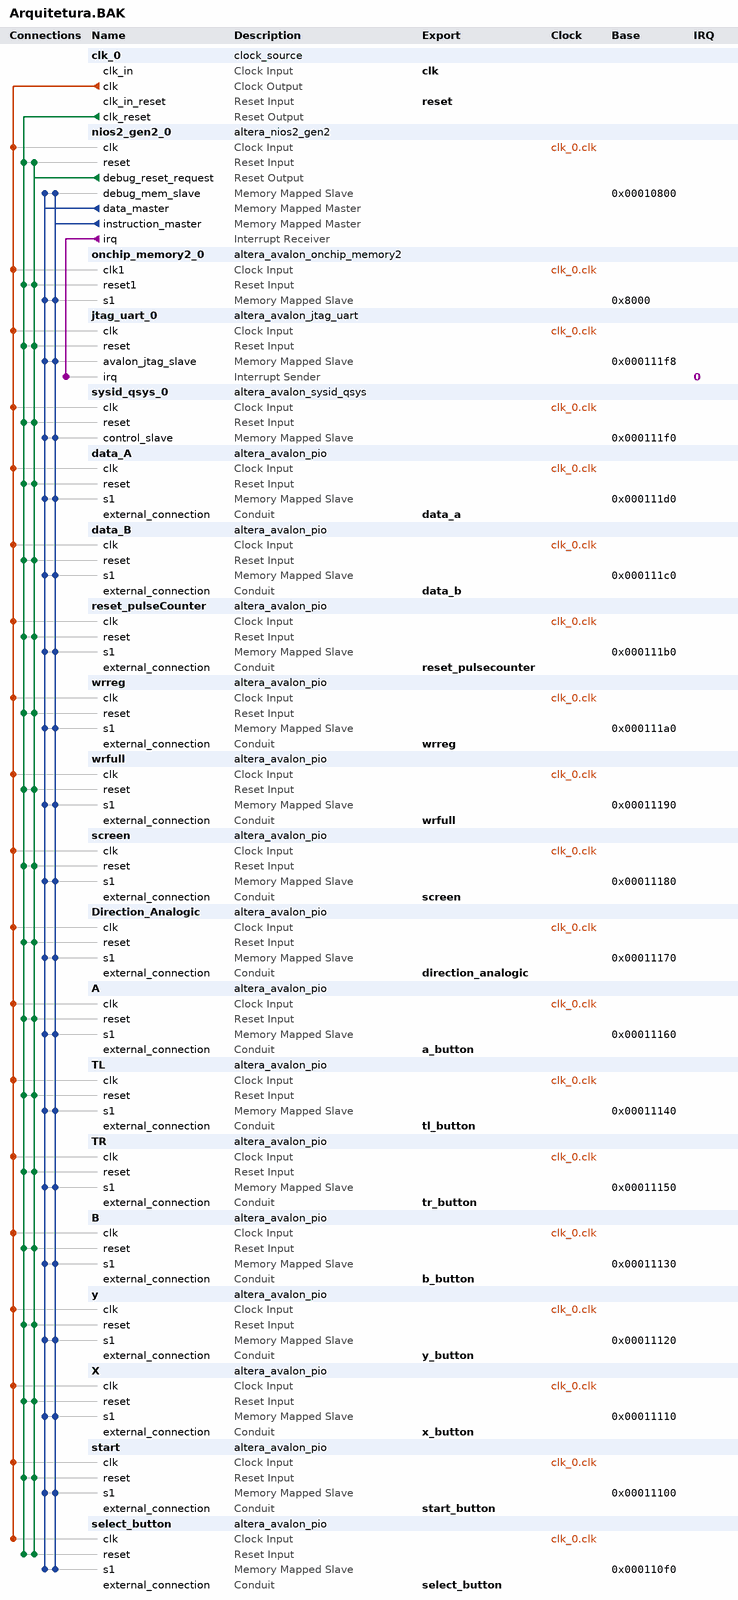
[diagram p0: system contents]
# Platform Designer (Qsys) system Arquitetura.BAK, Cyclone IV E EP4CE22F17C6
# Parameters at their usual value, and those the tool derives, are not listed.
package require -exact qsys 20.1
create_system Arquitetura.BAK
set_project_property DEVICE_FAMILY {Cyclone IV E}
set_project_property DEVICE EP4CE22F17C6

add_instance clk_0 clock_source 20.1
set_instance_parameter_value clk_0 clockFrequency 50000000

add_instance nios2_gen2_0 altera_nios2_gen2 20.1
set_instance_parameter_value nios2_gen2_0 dcache_size 2048
set_instance_parameter_value nios2_gen2_0 exceptionSlave onchip_memory2_0.s1
set_instance_parameter_value nios2_gen2_0 icache_size 4096
set_instance_parameter_value nios2_gen2_0 impl Tiny
set_instance_parameter_value nios2_gen2_0 resetSlave onchip_memory2_0.s1

add_instance onchip_memory2_0 altera_avalon_onchip_memory2 20.1
set_instance_parameter_value onchip_memory2_0 dataWidth 32
set_instance_parameter_value onchip_memory2_0 dualPort false
set_instance_parameter_value onchip_memory2_0 initMemContent true
set_instance_parameter_value onchip_memory2_0 initializationFileName onchip_mem.hex
set_instance_parameter_value onchip_memory2_0 memorySize 30000

add_instance jtag_uart_0 altera_avalon_jtag_uart 20.1
set_instance_parameter_value jtag_uart_0 simInteractiveOptions NO_INTERACTIVE_WINDOWS

add_instance sysid_qsys_0 altera_avalon_sysid_qsys 20.1
set_instance_parameter_value sysid_qsys_0 id 0

add_instance data_A altera_avalon_pio 20.1
set_instance_parameter_value data_A direction Output
set_instance_parameter_value data_A width 32

add_instance data_B altera_avalon_pio 20.1
set_instance_parameter_value data_B direction Output
set_instance_parameter_value data_B width 32

add_instance reset_pulseCounter altera_avalon_pio 20.1
set_instance_parameter_value reset_pulseCounter direction Output
set_instance_parameter_value reset_pulseCounter width 1

add_instance wrreg altera_avalon_pio 20.1
set_instance_parameter_value wrreg direction Output
set_instance_parameter_value wrreg width 1

add_instance wrfull altera_avalon_pio 20.1
set_instance_parameter_value wrfull direction Input
set_instance_parameter_value wrfull width 1

add_instance screen altera_avalon_pio 20.1
set_instance_parameter_value screen direction Input
set_instance_parameter_value screen width 1

add_instance Direction_Analogic altera_avalon_pio 20.1
set_instance_parameter_value Direction_Analogic direction Input
set_instance_parameter_value Direction_Analogic width 4

add_instance A altera_avalon_pio 20.1
set_instance_parameter_value A direction Input
set_instance_parameter_value A width 1

add_instance TL altera_avalon_pio 20.1
set_instance_parameter_value TL direction Input
set_instance_parameter_value TL width 1

add_instance TR altera_avalon_pio 20.1
set_instance_parameter_value TR direction Input
set_instance_parameter_value TR width 1

add_instance B altera_avalon_pio 20.1
set_instance_parameter_value B direction Input
set_instance_parameter_value B width 1

add_instance y altera_avalon_pio 20.1
set_instance_parameter_value y direction Input
set_instance_parameter_value y width 1

add_instance X altera_avalon_pio 20.1
set_instance_parameter_value X direction Input
set_instance_parameter_value X width 1

add_instance start altera_avalon_pio 20.1
set_instance_parameter_value start direction Input
set_instance_parameter_value start width 1

add_instance select_button altera_avalon_pio 20.1
set_instance_parameter_value select_button direction Input
set_instance_parameter_value select_button width 1

# connections
add_connection clk_0.clk A.clk clock
add_connection clk_0.clk B.clk clock
add_connection clk_0.clk data_A.clk clock
add_connection clk_0.clk data_B.clk clock
add_connection clk_0.clk Direction_Analogic.clk clock
add_connection clk_0.clk jtag_uart_0.clk clock
add_connection clk_0.clk nios2_gen2_0.clk clock
add_connection clk_0.clk onchip_memory2_0.clk1 clock
add_connection clk_0.clk reset_pulseCounter.clk clock
add_connection clk_0.clk screen.clk clock
add_connection clk_0.clk select_button.clk clock
add_connection clk_0.clk start.clk clock
add_connection clk_0.clk sysid_qsys_0.clk clock
add_connection clk_0.clk TL.clk clock
add_connection clk_0.clk TR.clk clock
add_connection clk_0.clk wrfull.clk clock
add_connection clk_0.clk wrreg.clk clock
add_connection clk_0.clk X.clk clock
add_connection clk_0.clk y.clk clock
add_connection clk_0.clk_reset A.reset reset
add_connection clk_0.clk_reset B.reset reset
add_connection clk_0.clk_reset data_A.reset reset
add_connection clk_0.clk_reset data_B.reset reset
add_connection clk_0.clk_reset Direction_Analogic.reset reset
add_connection clk_0.clk_reset jtag_uart_0.reset reset
add_connection clk_0.clk_reset nios2_gen2_0.reset reset
add_connection clk_0.clk_reset onchip_memory2_0.reset1 reset
add_connection clk_0.clk_reset reset_pulseCounter.reset reset
add_connection clk_0.clk_reset screen.reset reset
add_connection clk_0.clk_reset select_button.reset reset
add_connection clk_0.clk_reset start.reset reset
add_connection clk_0.clk_reset sysid_qsys_0.reset reset
add_connection clk_0.clk_reset TL.reset reset
add_connection clk_0.clk_reset TR.reset reset
add_connection clk_0.clk_reset wrfull.reset reset
add_connection clk_0.clk_reset wrreg.reset reset
add_connection clk_0.clk_reset X.reset reset
add_connection clk_0.clk_reset y.reset reset
add_connection nios2_gen2_0.debug_reset_request A.reset reset
add_connection nios2_gen2_0.debug_reset_request B.reset reset
add_connection nios2_gen2_0.debug_reset_request data_A.reset reset
add_connection nios2_gen2_0.debug_reset_request data_B.reset reset
add_connection nios2_gen2_0.debug_reset_request Direction_Analogic.reset reset
add_connection nios2_gen2_0.debug_reset_request jtag_uart_0.reset reset
add_connection nios2_gen2_0.debug_reset_request nios2_gen2_0.reset reset
add_connection nios2_gen2_0.debug_reset_request onchip_memory2_0.reset1 reset
add_connection nios2_gen2_0.debug_reset_request reset_pulseCounter.reset reset
add_connection nios2_gen2_0.debug_reset_request screen.reset reset
add_connection nios2_gen2_0.debug_reset_request select_button.reset reset
add_connection nios2_gen2_0.debug_reset_request start.reset reset
add_connection nios2_gen2_0.debug_reset_request sysid_qsys_0.reset reset
add_connection nios2_gen2_0.debug_reset_request TL.reset reset
add_connection nios2_gen2_0.debug_reset_request TR.reset reset
add_connection nios2_gen2_0.debug_reset_request wrfull.reset reset
add_connection nios2_gen2_0.debug_reset_request wrreg.reset reset
add_connection nios2_gen2_0.debug_reset_request X.reset reset
add_connection nios2_gen2_0.debug_reset_request y.reset reset
add_connection nios2_gen2_0.data_master A.s1 avalon
set_connection_parameter_value nios2_gen2_0.data_master/A.s1 baseAddress 0x00011160
add_connection nios2_gen2_0.data_master B.s1 avalon
set_connection_parameter_value nios2_gen2_0.data_master/B.s1 baseAddress 0x00011130
add_connection nios2_gen2_0.data_master data_A.s1 avalon
set_connection_parameter_value nios2_gen2_0.data_master/data_A.s1 baseAddress 0x000111d0
add_connection nios2_gen2_0.data_master data_B.s1 avalon
set_connection_parameter_value nios2_gen2_0.data_master/data_B.s1 baseAddress 0x000111c0
add_connection nios2_gen2_0.data_master Direction_Analogic.s1 avalon
set_connection_parameter_value nios2_gen2_0.data_master/Direction_Analogic.s1 baseAddress 0x00011170
add_connection nios2_gen2_0.data_master jtag_uart_0.avalon_jtag_slave avalon
set_connection_parameter_value nios2_gen2_0.data_master/jtag_uart_0.avalon_jtag_slave baseAddress 0x000111f8
add_connection nios2_gen2_0.data_master nios2_gen2_0.debug_mem_slave avalon
set_connection_parameter_value nios2_gen2_0.data_master/nios2_gen2_0.debug_mem_slave baseAddress 0x00010800
add_connection nios2_gen2_0.data_master onchip_memory2_0.s1 avalon
set_connection_parameter_value nios2_gen2_0.data_master/onchip_memory2_0.s1 baseAddress 0x8000
add_connection nios2_gen2_0.data_master reset_pulseCounter.s1 avalon
set_connection_parameter_value nios2_gen2_0.data_master/reset_pulseCounter.s1 baseAddress 0x000111b0
add_connection nios2_gen2_0.data_master screen.s1 avalon
set_connection_parameter_value nios2_gen2_0.data_master/screen.s1 baseAddress 0x00011180
add_connection nios2_gen2_0.data_master select_button.s1 avalon
set_connection_parameter_value nios2_gen2_0.data_master/select_button.s1 baseAddress 0x000110f0
add_connection nios2_gen2_0.data_master start.s1 avalon
set_connection_parameter_value nios2_gen2_0.data_master/start.s1 baseAddress 0x00011100
add_connection nios2_gen2_0.data_master sysid_qsys_0.control_slave avalon
set_connection_parameter_value nios2_gen2_0.data_master/sysid_qsys_0.control_slave baseAddress 0x000111f0
add_connection nios2_gen2_0.data_master TL.s1 avalon
set_connection_parameter_value nios2_gen2_0.data_master/TL.s1 baseAddress 0x00011140
add_connection nios2_gen2_0.data_master TR.s1 avalon
set_connection_parameter_value nios2_gen2_0.data_master/TR.s1 baseAddress 0x00011150
add_connection nios2_gen2_0.data_master wrfull.s1 avalon
set_connection_parameter_value nios2_gen2_0.data_master/wrfull.s1 baseAddress 0x00011190
add_connection nios2_gen2_0.data_master wrreg.s1 avalon
set_connection_parameter_value nios2_gen2_0.data_master/wrreg.s1 baseAddress 0x000111a0
add_connection nios2_gen2_0.data_master X.s1 avalon
set_connection_parameter_value nios2_gen2_0.data_master/X.s1 baseAddress 0x00011110
add_connection nios2_gen2_0.data_master y.s1 avalon
set_connection_parameter_value nios2_gen2_0.data_master/y.s1 baseAddress 0x00011120
add_connection nios2_gen2_0.instruction_master A.s1 avalon
set_connection_parameter_value nios2_gen2_0.instruction_master/A.s1 baseAddress 0x00011160
add_connection nios2_gen2_0.instruction_master B.s1 avalon
set_connection_parameter_value nios2_gen2_0.instruction_master/B.s1 baseAddress 0x00011130
add_connection nios2_gen2_0.instruction_master data_A.s1 avalon
set_connection_parameter_value nios2_gen2_0.instruction_master/data_A.s1 baseAddress 0x000111d0
add_connection nios2_gen2_0.instruction_master data_B.s1 avalon
set_connection_parameter_value nios2_gen2_0.instruction_master/data_B.s1 baseAddress 0x000111c0
add_connection nios2_gen2_0.instruction_master Direction_Analogic.s1 avalon
set_connection_parameter_value nios2_gen2_0.instruction_master/Direction_Analogic.s1 baseAddress 0x00011170
add_connection nios2_gen2_0.instruction_master jtag_uart_0.avalon_jtag_slave avalon
set_connection_parameter_value nios2_gen2_0.instruction_master/jtag_uart_0.avalon_jtag_slave baseAddress 0x000111f8
add_connection nios2_gen2_0.instruction_master nios2_gen2_0.debug_mem_slave avalon
set_connection_parameter_value nios2_gen2_0.instruction_master/nios2_gen2_0.debug_mem_slave baseAddress 0x00010800
add_connection nios2_gen2_0.instruction_master onchip_memory2_0.s1 avalon
set_connection_parameter_value nios2_gen2_0.instruction_master/onchip_memory2_0.s1 baseAddress 0x8000
add_connection nios2_gen2_0.instruction_master reset_pulseCounter.s1 avalon
set_connection_parameter_value nios2_gen2_0.instruction_master/reset_pulseCounter.s1 baseAddress 0x000111b0
add_connection nios2_gen2_0.instruction_master screen.s1 avalon
set_connection_parameter_value nios2_gen2_0.instruction_master/screen.s1 baseAddress 0x00011180
add_connection nios2_gen2_0.instruction_master select_button.s1 avalon
set_connection_parameter_value nios2_gen2_0.instruction_master/select_button.s1 baseAddress 0x000110f0
add_connection nios2_gen2_0.instruction_master start.s1 avalon
set_connection_parameter_value nios2_gen2_0.instruction_master/start.s1 baseAddress 0x00011100
add_connection nios2_gen2_0.instruction_master sysid_qsys_0.control_slave avalon
set_connection_parameter_value nios2_gen2_0.instruction_master/sysid_qsys_0.control_slave baseAddress 0x000111f0
add_connection nios2_gen2_0.instruction_master TL.s1 avalon
set_connection_parameter_value nios2_gen2_0.instruction_master/TL.s1 baseAddress 0x00011140
add_connection nios2_gen2_0.instruction_master TR.s1 avalon
set_connection_parameter_value nios2_gen2_0.instruction_master/TR.s1 baseAddress 0x00011150
add_connection nios2_gen2_0.instruction_master wrfull.s1 avalon
set_connection_parameter_value nios2_gen2_0.instruction_master/wrfull.s1 baseAddress 0x00011190
add_connection nios2_gen2_0.instruction_master wrreg.s1 avalon
set_connection_parameter_value nios2_gen2_0.instruction_master/wrreg.s1 baseAddress 0x000111a0
add_connection nios2_gen2_0.instruction_master X.s1 avalon
set_connection_parameter_value nios2_gen2_0.instruction_master/X.s1 baseAddress 0x00011110
add_connection nios2_gen2_0.instruction_master y.s1 avalon
set_connection_parameter_value nios2_gen2_0.instruction_master/y.s1 baseAddress 0x00011120
add_connection nios2_gen2_0.irq jtag_uart_0.irq interrupt
set_connection_parameter_value nios2_gen2_0.irq/jtag_uart_0.irq irqNumber 0

# exported interfaces
add_interface a_button conduit end
set_interface_property a_button EXPORT_OF A.external_connection
add_interface b_button conduit end
set_interface_property b_button EXPORT_OF B.external_connection
add_interface clk clock sink
set_interface_property clk EXPORT_OF clk_0.clk_in
add_interface data_a conduit end
set_interface_property data_a EXPORT_OF data_A.external_connection
add_interface data_b conduit end
set_interface_property data_b EXPORT_OF data_B.external_connection
add_interface direction_analogic conduit end
set_interface_property direction_analogic EXPORT_OF Direction_Analogic.external_connection
add_interface reset reset sink
set_interface_property reset EXPORT_OF clk_0.clk_in_reset
add_interface reset_pulsecounter conduit end
set_interface_property reset_pulsecounter EXPORT_OF reset_pulseCounter.external_connection
add_interface screen conduit end
set_interface_property screen EXPORT_OF screen.external_connection
add_interface select_button conduit end
set_interface_property select_button EXPORT_OF select_button.external_connection
add_interface start_button conduit end
set_interface_property start_button EXPORT_OF start.external_connection
add_interface tl_button conduit end
set_interface_property tl_button EXPORT_OF TL.external_connection
add_interface tr_button conduit end
set_interface_property tr_button EXPORT_OF TR.external_connection
add_interface wrfull conduit end
set_interface_property wrfull EXPORT_OF wrfull.external_connection
add_interface wrreg conduit end
set_interface_property wrreg EXPORT_OF wrreg.external_connection
add_interface x_button conduit end
set_interface_property x_button EXPORT_OF X.external_connection
add_interface y_button conduit end
set_interface_property y_button EXPORT_OF y.external_connection

set_interconnect_requirement {$system} qsys_mm.clockCrossingAdapter HANDSHAKE
set_interconnect_requirement {$system} qsys_mm.enableEccProtection FALSE
set_interconnect_requirement {$system} qsys_mm.insertDefaultSlave FALSE
set_interconnect_requirement {$system} qsys_mm.maxAdditionalLatency 1

save_system Arquitetura.BAK.qsys
